# Altium schematic sheet IMU_SCH.SchDoc
size A
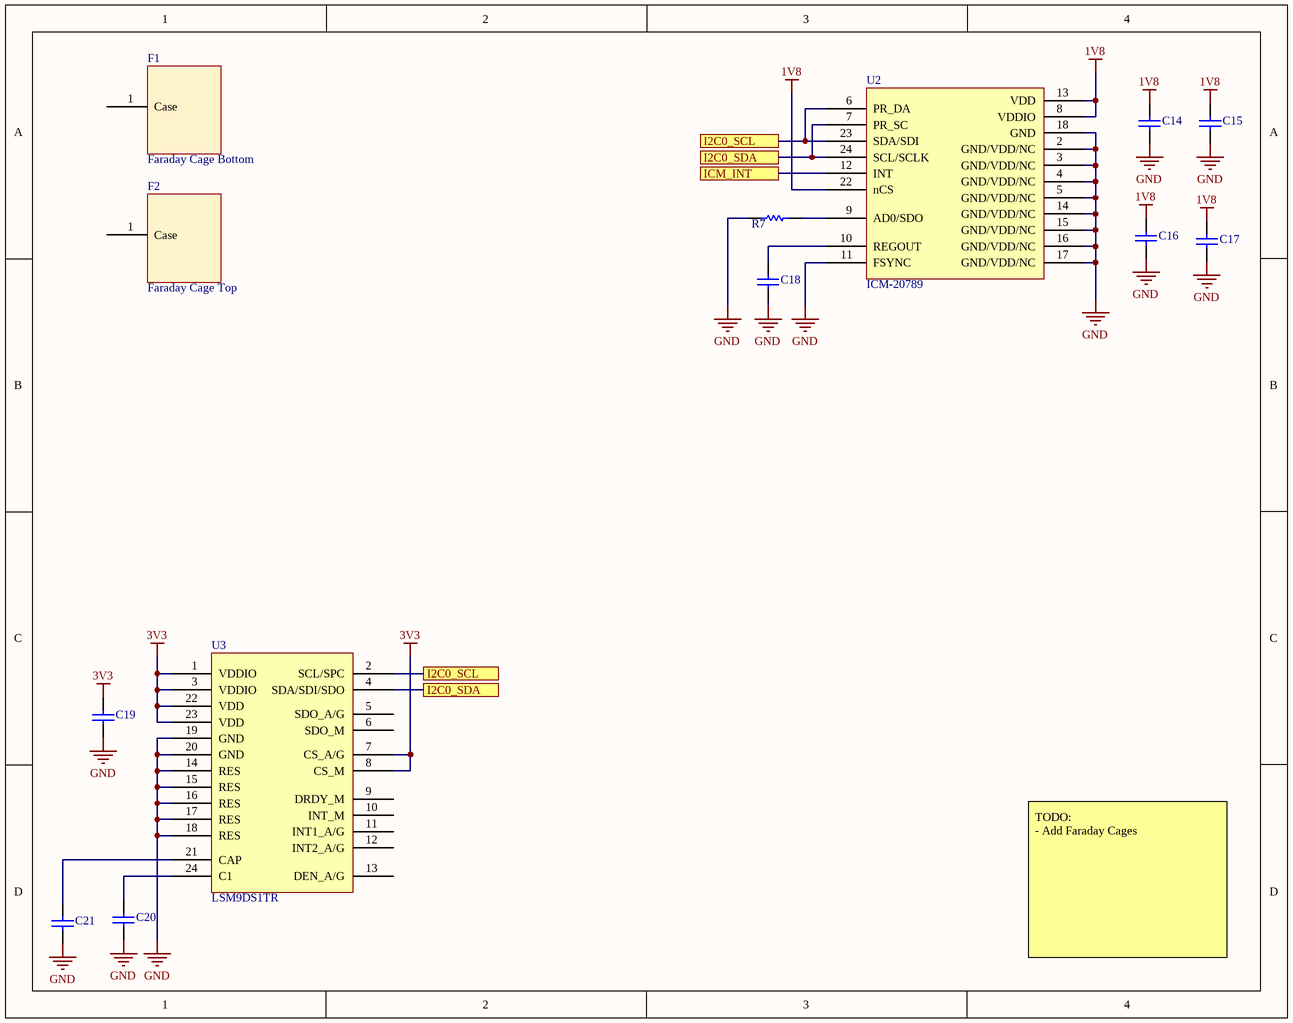
[diagram p0: IMU_SCH.SchDoc]

## Parts
C14  08055C104KAJ2A  [CAPC2013X140X50NL20T25]  (value not drawn)
C15  08055C104KAJ2A  [CAPC2013X140X50NL20T25]  (value not drawn)
C16  08055C104KAJ2A  [CAPC2013X140X50NL20T25]  (value not drawn)
C17  08055C104KAJ2A  [CAPC2013X140X50NL20T25]  (value not drawn)
C18  08055C104KAJ2A  [CAPC2013X140X50NL20T25]  (value not drawn)
C19  08055C104KAJ2A  [CAPC2013X140X50NL20T25]  (value not drawn)
C20  08055C104KAJ2A  [CAPC2013X140X50NL20T25]  (value not drawn)
C21  08055C104KAJ2A  [CAPC2013X140X50NL20T25]  (value not drawn)
F1  Faraday Cage Bottom
F2  Faraday Cage Top
R7  ERJ-6ENF1503V  [RESC2013X70X40LL20T20]  (value not drawn)
U2  ICM-20789  [24LGA]
U3  LSM9DS1TR  [24LGA_Elongated]

## Ports
I2C0_SCL, I2C0_SDA, ICM_INT

## Nets
1V8: C14.2 C15.2 C16.2 C17.2 U2.8(VDDIO) U2.13(VDD) U2.22(nCS)
3V3: C19.2 U3.1(VDDIO) U3.3(VDDIO) U3.7(CS_A/G) U3.8(CS_M) U3.22(VDD) U3.23(VDD)
GND: C14.1 C15.1 C16.1 C17.1 C18.1 C19.1 C20.1 C21.1 R7.1 U2.2(GND/VDD/NC) U2.3(GND/VDD/NC) U2.4(GND/VDD/NC) U2.5(GND/VDD/NC) U2.11(FSYNC) U2.14(GND/VDD/NC) U2.15(GND/VDD/NC) U2.16(GND/VDD/NC) U2.17(GND/VDD/NC) U2.18(GND) U3.14(RES) U3.15(RES) U3.16(RES) U3.17(RES) U3.18(RES) U3.19(GND) U3.20(GND)
I2C0_SCL: U2.6(PR_DA) U2.23(SDA/SDI) U3.2(SCL/SPC) ; port I2C0_SCL
I2C0_SDA: U2.7(PR_SC) U2.24(SCL/SCLK) U3.4(SDA/SDI/SDO) ; port I2C0_SDA
ICM_INT: U2.12(INT) ; port ICM_INT
NetC18_2: C18.2 U2.10(REGOUT)
NetC20_2: C20.2 U3.24(C1)
NetC21_2: C21.2 U3.21(CAP)
NetR7_2: R7.2 U2.9(AD0/SDO)

Not connected (* = marked no-connect by the designer): F1 1(Case); F2 1(Case); U3 5(SDO_A/G) 6(SDO_M) 9(DRDY_M) 10(INT_M) 11(INT1_A/G) 12(INT2_A/G) 13(DEN_A/G)

## Notes on the sheet
- TODO:
  - Add Faraday Cages

## Library data of the parts
C14-C21 = CMP-2007-04765-1: Manufacturer: AVX Interconnect / Elco; Part Number: 08055C104KAJ2A
F1 F2 = FARADAY_CAGE
R7 = CMP-2001-04440-2: RES SMD 150K OHM 1% 1/8W 0805; Manufacturer: Panasonic; Datasheet: http://industrial.panasonic.com/cdbs/www-data/pdf/RDA0000/AOA0000C86.pdf; Part Number: ERJ-6ENF1503V
U2 = ICM-20789: MOTION SENSOR IC; ComponentLink1Description: DigiKey; ComponentLink1URL: https://www.digikey.com/product-detail/en/tdk-invensense/ICM-20789/1428-1133-6-ND/
U3 = LSM9DS1TR: IMU ACCEL/GYRO/MAG I2C/SPI 24LGA; ComponentLink1Description: DigiKey; ComponentLink1URL: https://www.digikey.com/product-detail/en/stmicroelectronics/LSM9DS1TR/497-14946-1-ND/